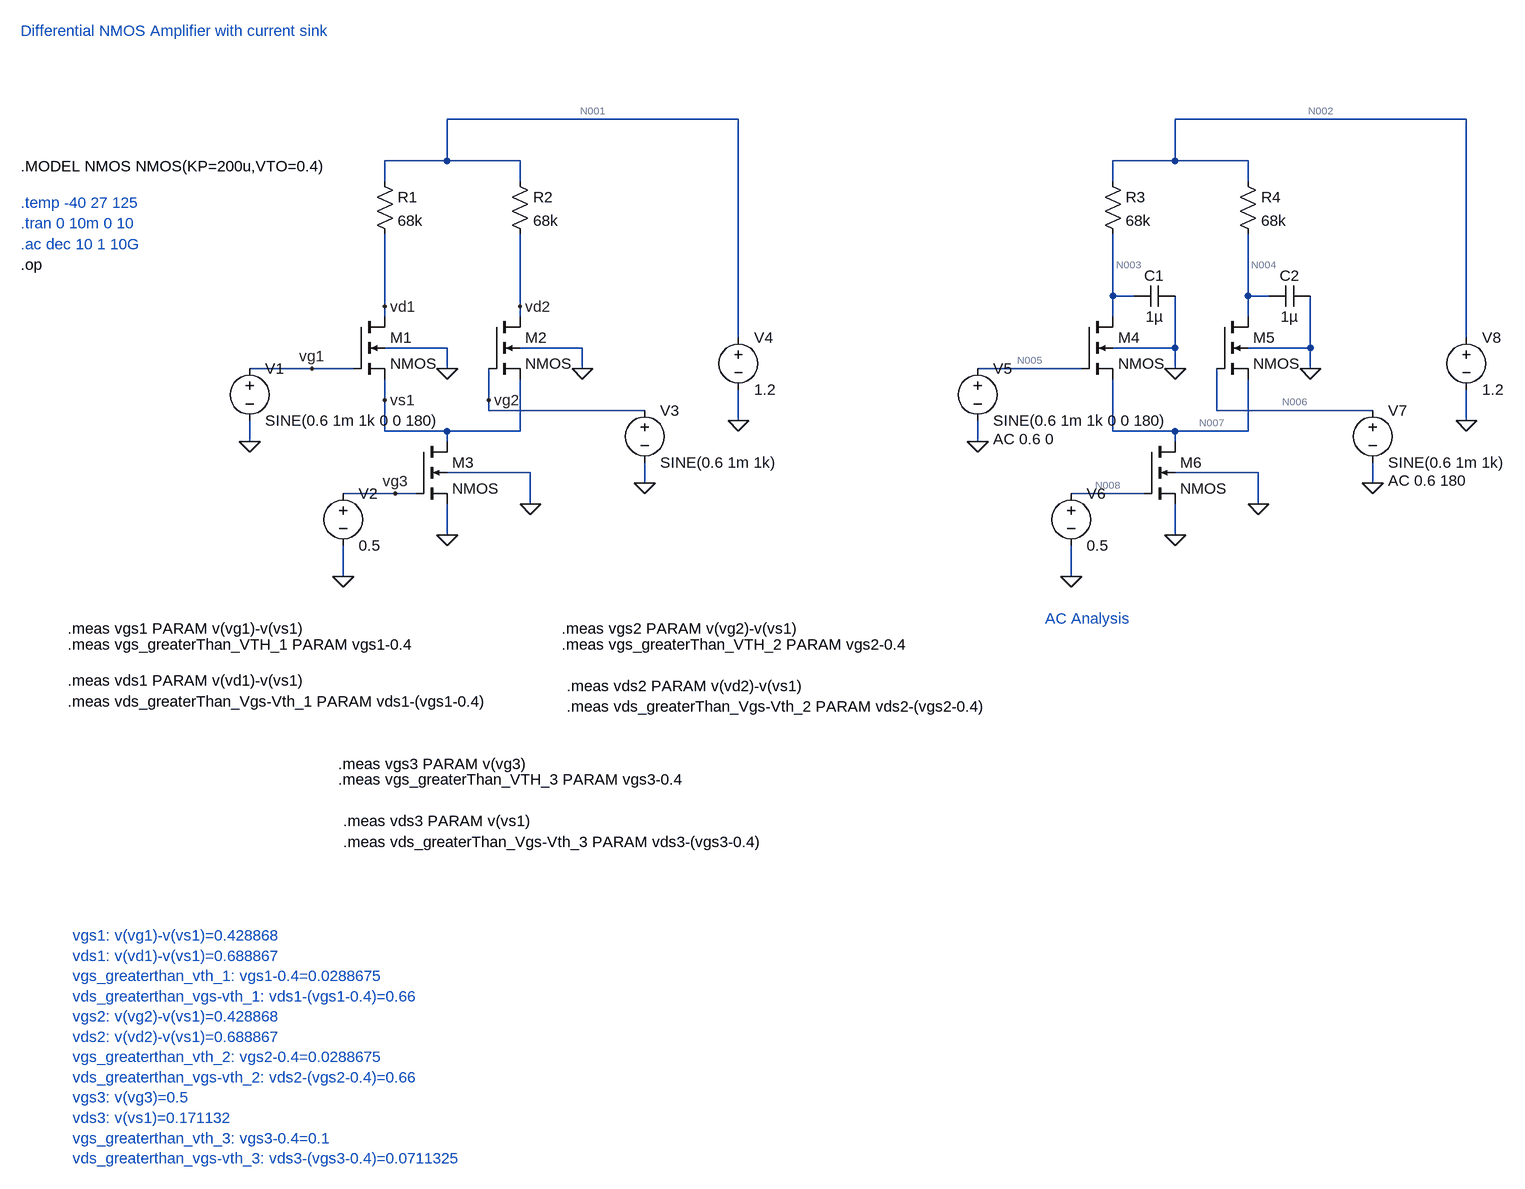
[diagram p0: schematic 1_Differential_amplifier.asc]
1_Differential_amplifier.asc, the LTspice schematic file:
Version 4
SHEET 1 2076 1308
WIRE 672 -272 224 -272
WIRE 1792 -272 1344 -272
WIRE 224 -208 224 -272
WIRE 224 -208 128 -208
WIRE 336 -208 224 -208
WIRE 1344 -208 1344 -272
WIRE 1344 -208 1248 -208
WIRE 1456 -208 1344 -208
WIRE 128 -176 128 -208
WIRE 336 -176 336 -208
WIRE 1248 -176 1248 -208
WIRE 1456 -176 1456 -208
WIRE 1248 0 1248 -96
WIRE 1280 0 1248 0
WIRE 1456 0 1456 -96
WIRE 1488 0 1456 0
WIRE 128 16 128 -96
WIRE 336 16 336 -96
WIRE 128 32 128 16
WIRE 336 32 336 16
WIRE 1248 32 1248 0
WIRE 1456 32 1456 0
WIRE 672 64 672 -272
WIRE 1792 64 1792 -272
WIRE 224 80 128 80
WIRE 432 80 336 80
WIRE 1344 80 1344 0
WIRE 1344 80 1248 80
WIRE 1552 80 1552 0
WIRE 1552 80 1456 80
WIRE 16 112 -80 112
WIRE 80 112 16 112
WIRE 224 112 224 80
WIRE 432 112 432 80
WIRE 1200 112 1040 112
WIRE 1344 112 1344 80
WIRE 1552 112 1552 80
WIRE 128 160 128 128
WIRE 288 160 288 112
WIRE 288 176 288 160
WIRE 528 176 288 176
WIRE 1408 176 1408 112
WIRE 1648 176 1408 176
WIRE 672 192 672 144
WIRE 1792 192 1792 144
WIRE 128 208 128 160
WIRE 224 208 128 208
WIRE 336 208 336 128
WIRE 336 208 224 208
WIRE 1248 208 1248 128
WIRE 1344 208 1248 208
WIRE 1456 208 1456 128
WIRE 1456 208 1344 208
WIRE -80 224 -80 192
WIRE 224 224 224 208
WIRE 1040 224 1040 192
WIRE 1344 224 1344 208
WIRE 352 272 224 272
WIRE 1472 272 1344 272
WIRE 528 288 528 256
WIRE 1648 288 1648 256
WIRE 144 304 64 304
WIRE 176 304 144 304
WIRE 1296 304 1184 304
WIRE 352 320 352 272
WIRE 1472 320 1472 272
WIRE 224 368 224 320
WIRE 1344 368 1344 320
WIRE 64 432 64 384
WIRE 1184 432 1184 384
FLAG -80 224 0
FLAG 224 368 0
FLAG 224 112 0
FLAG 432 112 0
FLAG 528 288 0
FLAG 672 192 0
FLAG 64 432 0
FLAG 352 320 0
FLAG 1040 224 0
FLAG 1344 368 0
FLAG 1344 112 0
FLAG 1552 112 0
FLAG 1648 288 0
FLAG 1792 192 0
FLAG 1184 432 0
FLAG 1472 320 0
FLAG 16 112 vg1
FLAG 128 160 vs1
FLAG 128 16 vd1
FLAG 288 160 vg2
FLAG 336 16 vd2
FLAG 144 304 vg3
SYMBOL nmos4 80 32 R0
SYMATTR InstName M1
SYMATTR Value2 l=1u w=60u
SYMBOL nmos4 288 32 R0
SYMATTR InstName M2
SYMATTR Value2 l=1u w=60u
SYMBOL nmos4 176 224 R0
SYMATTR InstName M3
SYMATTR Value2 l=1u w=10u
SYMBOL voltage -80 96 R0
WINDOW 123 0 0 Left 0
WINDOW 39 0 0 Left 0
SYMATTR InstName V1
SYMATTR Value SINE(0.6 1m 1k 0 0 180)
SYMBOL voltage 64 288 R0
WINDOW 123 0 0 Left 0
WINDOW 39 0 0 Left 0
SYMATTR InstName V2
SYMATTR Value 0.5
SYMBOL voltage 528 160 R0
WINDOW 123 0 0 Left 0
WINDOW 39 0 0 Left 0
SYMATTR InstName V3
SYMATTR Value SINE(0.6 1m 1k)
SYMBOL voltage 672 48 R0
WINDOW 123 0 0 Left 0
WINDOW 39 0 0 Left 0
SYMATTR InstName V4
SYMATTR Value 1.2
SYMBOL res 112 -192 R0
SYMATTR InstName R1
SYMATTR Value 68k
SYMBOL res 320 -192 R0
SYMATTR InstName R2
SYMATTR Value 68k
SYMBOL nmos4 1200 32 R0
SYMATTR InstName M4
SYMATTR Value2 l=1u w=60u
SYMBOL nmos4 1408 32 R0
SYMATTR InstName M5
SYMATTR Value2 l=1u w=60u
SYMBOL nmos4 1296 224 R0
SYMATTR InstName M6
SYMATTR Value2 l=1u w=10u
SYMBOL voltage 1040 96 R0
WINDOW 123 24 124 Left 2
WINDOW 39 0 0 Left 0
SYMATTR Value2 AC 0.6 0
SYMATTR InstName V5
SYMATTR Value SINE(0.6 1m 1k 0 0 180)
SYMBOL voltage 1184 288 R0
WINDOW 123 0 0 Left 0
WINDOW 39 0 0 Left 0
SYMATTR InstName V6
SYMATTR Value 0.5
SYMBOL voltage 1648 160 R0
WINDOW 123 24 124 Left 2
WINDOW 39 0 0 Left 0
SYMATTR Value2 AC 0.6 180
SYMATTR InstName V7
SYMATTR Value SINE(0.6 1m 1k)
SYMBOL voltage 1792 48 R0
WINDOW 123 0 0 Left 0
WINDOW 39 0 0 Left 0
SYMATTR InstName V8
SYMATTR Value 1.2
SYMBOL res 1232 -192 R0
SYMATTR InstName R3
SYMATTR Value 68k
SYMBOL res 1440 -192 R0
SYMATTR InstName R4
SYMATTR Value 68k
SYMBOL cap 1344 -16 R90
WINDOW 0 0 32 VBottom 2
WINDOW 3 32 32 VTop 2
SYMATTR InstName C1
SYMATTR Value 1µ
SYMBOL cap 1552 -16 R90
WINDOW 0 0 32 VBottom 2
WINDOW 3 32 32 VTop 2
SYMATTR InstName C2
SYMATTR Value 1µ
TEXT -432 -408 Left 2 ;Differential NMOS Amplifier with current sink
TEXT -432 -200 Left 2 !.MODEL NMOS NMOS(KP=200u,VTO=0.4)
TEXT -432 -112 Left 2 ;.tran 0 10m 0 10
TEXT 1144 496 Left 2 ;AC Analysis
TEXT -360 512 Left 2 !.meas vgs1 PARAM v(vg1)-v(vs1)
TEXT -360 592 Left 2 !.meas vds1 PARAM v(vd1)-v(vs1)
TEXT -360 536 Left 2 !.meas vgs_greaterThan_VTH_1 PARAM vgs1-0.4
TEXT -360 624 Left 2 !.meas vds_greaterThan_Vgs-Vth_1 PARAM vds1-(vgs1-0.4)
TEXT 400 512 Left 2 !.meas vgs2 PARAM v(vg2)-v(vs1)
TEXT 408 600 Left 2 !.meas vds2 PARAM v(vd2)-v(vs1)
TEXT 400 536 Left 2 !.meas vgs_greaterThan_VTH_2 PARAM vgs2-0.4
TEXT 408 632 Left 2 !.meas vds_greaterThan_Vgs-Vth_2 PARAM vds2-(vgs2-0.4)
TEXT 56 720 Left 2 !.meas vgs3 PARAM v(vg3)
TEXT 64 808 Left 2 !.meas vds3 PARAM v(vs1)
TEXT 56 744 Left 2 !.meas vgs_greaterThan_VTH_3 PARAM vgs3-0.4
TEXT 64 840 Left 2 !.meas vds_greaterThan_Vgs-Vth_3 PARAM vds3-(vgs3-0.4)
TEXT -432 -80 Left 2 ;.ac dec 10 1 10G
TEXT -432 -48 Left 2 !.op
TEXT -432 -144 Left 2 ;.temp -40 27 125
TEXT -352 984 Left 2 ;vgs1: v(vg1)-v(vs1)=0.428868\nvds1: v(vd1)-v(vs1)=0.688867\nvgs_greaterthan_vth_1: vgs1-0.4=0.0288675\nvds_greaterthan_vgs-vth_1: vds1-(vgs1-0.4)=0.66\nvgs2: v(vg2)-v(vs1)=0.428868\nvds2: v(vd2)-v(vs1)=0.688867\nvgs_greaterthan_vth_2: vgs2-0.4=0.0288675\nvds_greaterthan_vgs-vth_2: vds2-(vgs2-0.4)=0.66\nvgs3: v(vg3)=0.5\nvds3: v(vs1)=0.171132\nvgs_greaterthan_vth_3: vgs3-0.4=0.1\nvds_greaterthan_vgs-vth_3: vds3-(vgs3-0.4)=0.0711325

The netlist it stands for:
* 1_Differential_amplifier.asc
M1 vd1 vg1 vs1 0 NMOS l=1u w=60u
M2 vd2 vg2 vs1 0 NMOS l=1u w=60u
M3 vs1 vg3 0 0 NMOS l=1u w=10u
V1 vg1 0 SINE(0.6 1m 1k 0 0 180)
V2 vg3 0 0.5
V3 vg2 0 SINE(0.6 1m 1k)
V4 N001 0 1.2
R1 N001 vd1 68k
R2 N001 vd2 68k
M4 N003 N005 N007 0 NMOS l=1u w=60u
M5 N004 N006 N007 0 NMOS l=1u w=60u
M6 N007 N008 0 0 NMOS l=1u w=10u
V5 N005 0 SINE(0.6 1m 1k 0 0 180) AC 0.6 0
V6 N008 0 0.5
V7 N006 0 SINE(0.6 1m 1k) AC 0.6 180
V8 N002 0 1.2
R3 N002 N003 68k
R4 N002 N004 68k
C1 0 N003 1µ
C2 0 N004 1µ
.model NMOS NMOS
.model PMOS PMOS
.lib standard.mos
* Differential NMOS Amplifier with current sink
.MODEL NMOS NMOS(KP=200u,VTO=0.4)
* .tran 0 10m 0 10
* AC Analysis
.meas vgs1 PARAM v(vg1)-v(vs1)
.meas vds1 PARAM v(vd1)-v(vs1)
.meas vgs_greaterThan_VTH_1 PARAM vgs1-0.4
.meas vds_greaterThan_Vgs-Vth_1 PARAM vds1-(vgs1-0.4)
.meas vgs2 PARAM v(vg2)-v(vs1)
.meas vds2 PARAM v(vd2)-v(vs1)
.meas vgs_greaterThan_VTH_2 PARAM vgs2-0.4
.meas vds_greaterThan_Vgs-Vth_2 PARAM vds2-(vgs2-0.4)
.meas vgs3 PARAM v(vg3)
.meas vds3 PARAM v(vs1)
.meas vgs_greaterThan_VTH_3 PARAM vgs3-0.4
.meas vds_greaterThan_Vgs-Vth_3 PARAM vds3-(vgs3-0.4)
* .ac dec 10 1 10G
.op
* .temp -40 27 125
* vgs1: v(vg1)-v(vs1)=0.428868
* vds1: v(vd1)-v(vs1)=0.688867
* vgs_greaterthan_vth_1: vgs1-0.4=0.0288675
* vds_greaterthan_vgs-vth_1: vds1-(vgs1-0.4)=0.66
* vgs2: v(vg2)-v(vs1)=0.428868
* vds2: v(vd2)-v(vs1)=0.688867
* vgs_greaterthan_vth_2: vgs2-0.4=0.0288675
* vds_greaterthan_vgs-vth_2: vds2-(vgs2-0.4)=0.66
* vgs3: v(vg3)=0.5
* vds3: v(vs1)=0.171132
* vgs_greaterthan_vth_3: vgs3-0.4=0.1
* vds_greaterthan_vgs-vth_3: vds3-(vgs3-0.4)=0.0711325
.backanno
.end

* Results of the author's LTspice run, read from the files saved beside the schematic
* Operating Point:
*   V(vd1) = 860 mV
*   V(vg1) = 600 mV
*   V(vs1) = 171.1 mV
*   V(vd2) = 860 mV
*   V(vg2) = 600 mV
*   V(vg3) = 500 mV
*   V(n001) = 1.2 V
*   V(n003) = 860 mV
*   V(n005) = 600 mV
*   V(n007) = 171.1 mV
*   V(n004) = 860 mV
*   V(n006) = 600 mV
*   V(n008) = 500 mV
*   V(n002) = 1.2 V
*   Id(M6) = 10 µA
*   Ig(M6) = 0 A
*   Ib(M6) = -181.1 fA
*   Is(M6) = -10 µA
*   Id(M5) = 5 µA
*   Ig(M5) = 0 A
*   Ib(M5) = -1.051 pA
*   Is(M5) = -5 µA
*   Id(M4) = 5 µA
*   Ig(M4) = 0 A
*   Ib(M4) = -1.051 pA
*   Is(M4) = -5 µA
*   Id(M3) = 10 µA
*   Ig(M3) = 0 A
*   Ib(M3) = -181.1 fA
*   Is(M3) = -10 µA
*   Id(M2) = 5 µA
*   Ig(M2) = 0 A
*   Ib(M2) = -1.051 pA
*   Is(M2) = -5 µA
*   Id(M1) = 5 µA
*   Ig(M1) = 0 A
*   Ib(M1) = -1.051 pA
*   Is(M1) = -5 µA
*   I(C2) = 0 A
*   I(C1) = 0 A
*   I(R4) = 5 µA
*   I(R3) = 5 µA
*   I(R2) = 5 µA
*   I(R1) = 5 µA
*   I(V8) = -10 µA
*   I(V7) = 0 A
*   I(V6) = 0 A
*   I(V5) = 0 A
*   I(V4) = -10 µA
*   I(V3) = 0 A
*   I(V2) = 0 A
*   I(V1) = 0 A
* From the log:
*   Semiconductor Device Operating Points:
*                           --- MOSFET Transistors ---
*   Name:          m6          m5          m4          m3          m2
*   Model:        nmos        nmos        nmos        nmos        nmos
*   Id:          1.00e-05    5.00e-06    5.00e-06    1.00e-05    5.00e-06
*   Vgs:         5.00e-01    4.29e-01    4.29e-01    5.00e-01    4.29e-01
*   Vds:         1.71e-01    6.89e-01    6.89e-01    1.71e-01    6.89e-01
*   Vbs:         0.00e+00   -1.71e-01   -1.71e-01    0.00e+00   -1.71e-01
*   Vth:         4.00e-01    4.00e-01    4.00e-01    4.00e-01    4.00e-01
*   Vdsat:       1.00e-01    2.89e-02    2.89e-02    1.00e-01    2.89e-02
*   Gm:          2.00e-04    3.46e-04    3.46e-04    2.00e-04    3.46e-04
*   Gds:         0.00e+00    0.00e+00    0.00e+00    0.00e+00    0.00e+00
*   Gmb:         0.00e+00    0.00e+00    0.00e+00    0.00e+00    0.00e+00
*   Cbd:         0.00e+00    0.00e+00    0.00e+00    0.00e+00    0.00e+00
*   Cbs:         0.00e+00    0.00e+00    0.00e+00    0.00e+00    0.00e+00
*   Cgsov:       0.00e+00    0.00e+00    0.00e+00    0.00e+00    0.00e+00
*   Cgdov:       0.00e+00    0.00e+00    0.00e+00    0.00e+00    0.00e+00
*   Cgbov:       0.00e+00    0.00e+00    0.00e+00    0.00e+00    0.00e+00
*   Cgs:         0.00e+00    0.00e+00    0.00e+00    0.00e+00    0.00e+00
*   Cgd:         0.00e+00    0.00e+00    0.00e+00    0.00e+00    0.00e+00
*   Cgb:         0.00e+00    0.00e+00    0.00e+00    0.00e+00    0.00e+00
*   Name:          m1
*   Model:        nmos
*   Id:          5.00e-06
*   Vgs:         4.29e-01
*   Vds:         6.89e-01
*   Vbs:        -1.71e-01
*   Vth:         4.00e-01
*   Vdsat:       2.89e-02
*   Gm:          3.46e-04
*   Gds:         0.00e+00
*   Gmb:         0.00e+00
*   Cbd:         0.00e+00
*   Cbs:         0.00e+00
*   Cgsov:       0.00e+00
*   Cgdov:       0.00e+00
*   Cgbov:       0.00e+00
*   Cgs:         0.00e+00
*   Cgd:         0.00e+00
*   Cgb:         0.00e+00
*   vgs1: v(vg1)-v(vs1)=0.428868
*   vds1: v(vd1)-v(vs1)=0.688867
*   vgs_greaterthan_vth_1: vgs1-0.4=0.0288675
*   vds_greaterthan_vgs-vth_1: vds1-(vgs1-0.4)=0.66
*   vgs2: v(vg2)-v(vs1)=0.428868
*   vds2: v(vd2)-v(vs1)=0.688867
*   vgs_greaterthan_vth_2: vgs2-0.4=0.0288675
*   vds_greaterthan_vgs-vth_2: vds2-(vgs2-0.4)=0.66
*   vgs3: v(vg3)=0.5
*   vds3: v(vs1)=0.171132
*   vgs_greaterthan_vth_3: vgs3-0.4=0.1
*   vds_greaterthan_vgs-vth_3: vds3-(vgs3-0.4)=0.0711325